# EAGLE schematic ZEROSTICK (EAGLE 9.6.2)

## Sheet 1 of 2
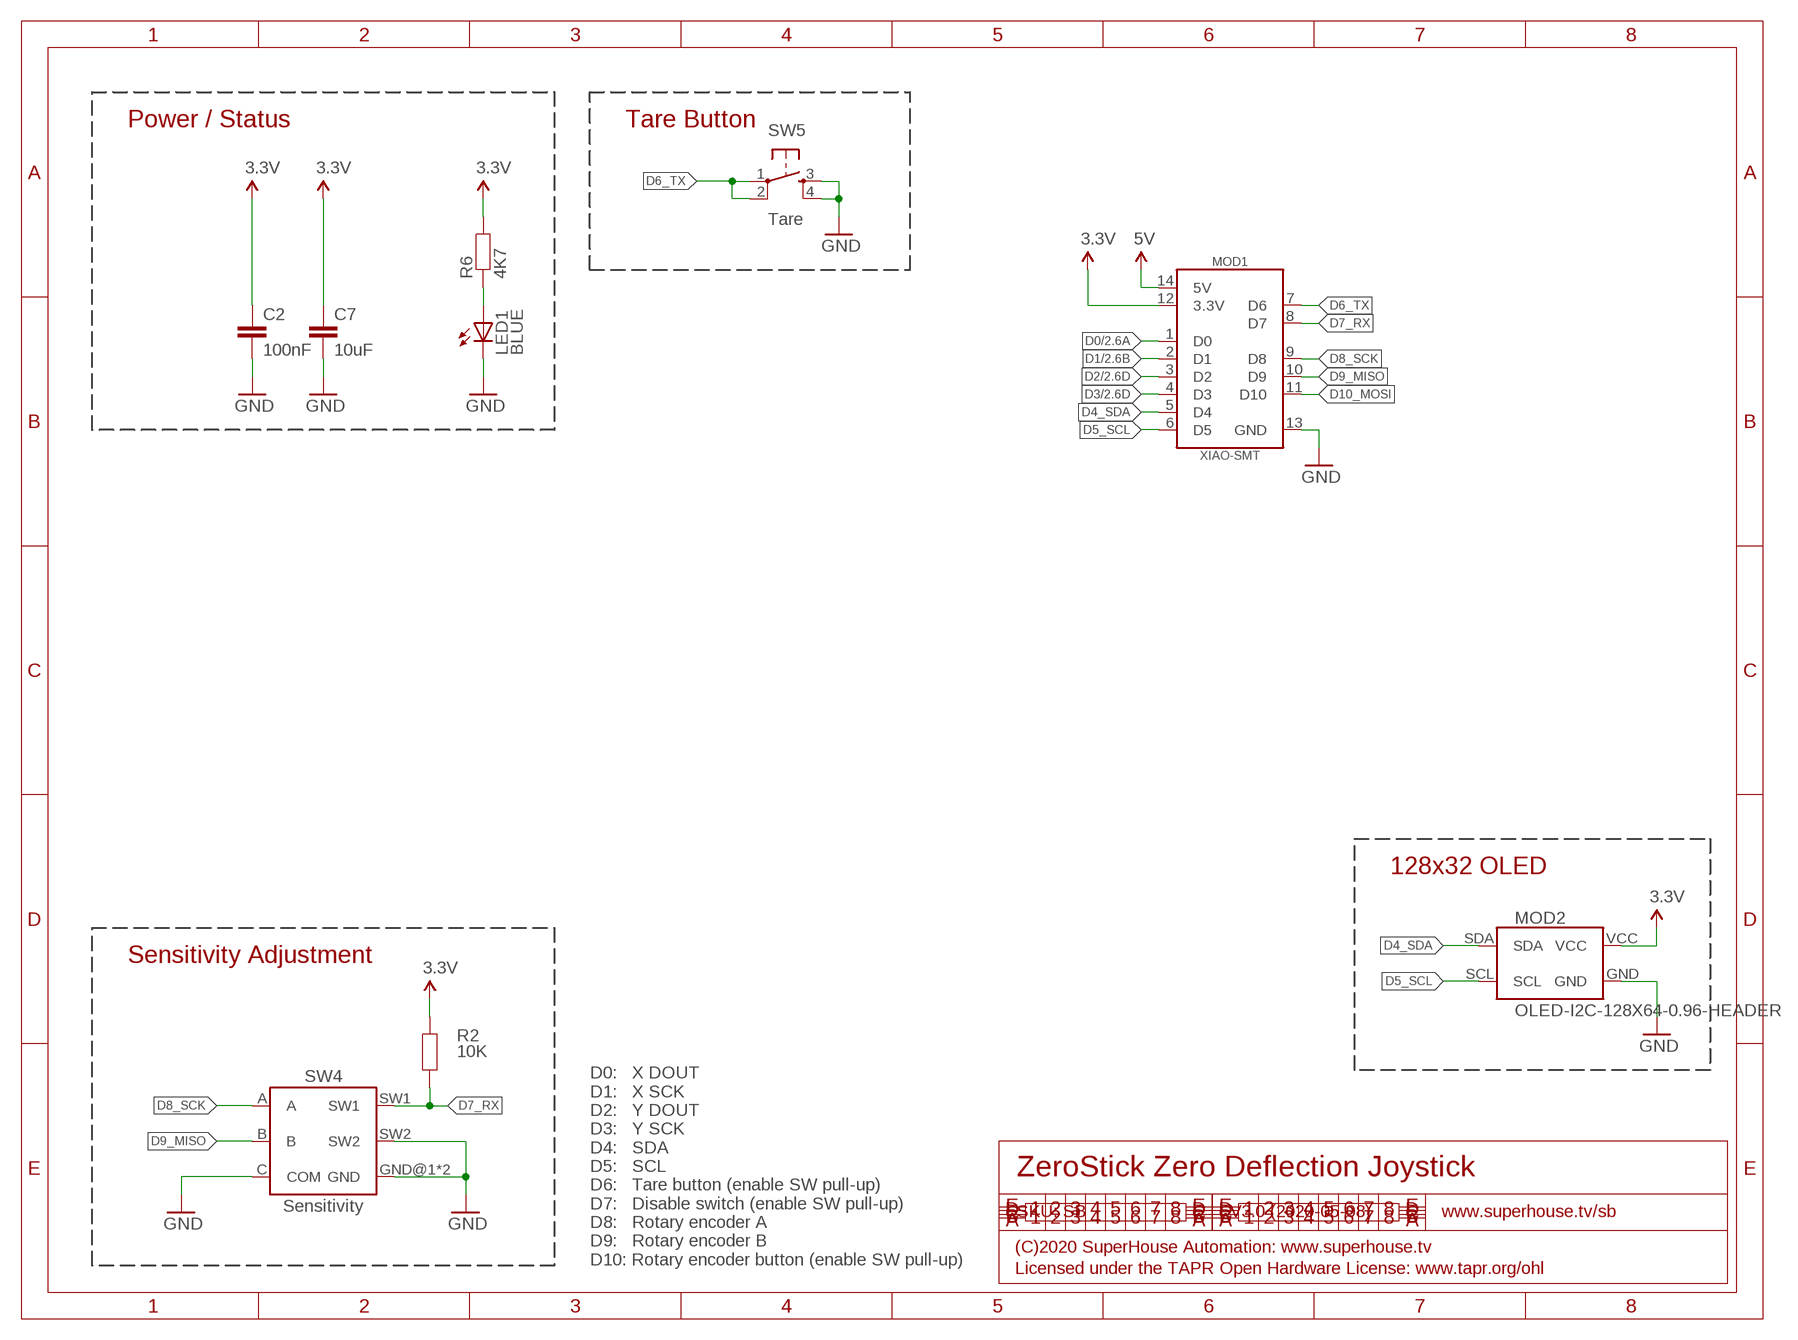
[diagram p0: schematic, sheet 1]

### Parts
C2  100nF  CAP0603  [C0603]
C7  10uF  CAP0805  [C0805]
LED1  BLUE  LED0603  [LED-0603]
MOD1  XIAO-SMT  [XIAO-SMT]
MOD2  OLED-I2C-128X64-0.96-HEADER  [OLED-128X64-0.96-HEADER]
R2  10K  RESISTOR0603  [R0603]
R6  4K7  RESISTOR0603  [R0603]
SW4  Sensitivity  ENCODER  [PEC12R]
SW5  Tare  TAC_SWITCH-PTH-4.5  [TACTILE-PTH-4.5MM]

### Nets
3.3V: C2.1 C7.1 MOD1.12(3.3V) MOD2.VCC R2.2 R6.2 ; also sheet 2
5V: MOD1.14(5V)
D0: MOD1.1(D0) ; also sheet 2
D1: MOD1.2(D1) ; also sheet 2
D2: MOD1.3(D2) ; also sheet 2
D3: MOD1.4(D3) ; also sheet 2
D4_SDA: MOD1.5(D4) MOD2.SDA
D5_SCL: MOD1.6(D5) MOD2.SCL
D6_TX: MOD1.7(D6) SW5.1 SW5.2
D7_RX: MOD1.8(D7) R2.1 SW4.SW1
D8_SCK: MOD1.9(D8) SW4.A
D9_MISO: MOD1.10(D9) SW4.B
D10_MOSI: MOD1.11(D10)
GND: C2.2 C7.2 LED1.C MOD1.13(GND) MOD2.GND SW4.C(COM) SW4.GND@1(GND) SW4.GND@2(GND) SW4.SW2 SW5.3 SW5.4 ; also sheet 2
N$5: LED1.A R6.1

### Notes on the sheet
- Power / Status | Tare Button
- 128x32 OLED
- Sensitivity Adjustment
- ZeroStick Zero Deflection Joystick
- SKU: SB | V3.0 (2020-05-08) | www.superhouse.tv/sb
- (C)2020 SuperHouse Automation: www.superhouse.tv
- D0:   X DOUT
  D1:   X SCK
  D2:   Y DOUT
  D3:   Y SCK
  D4:   SDA
  D5:   SCL
  D6:   Tare button (enable SW pull-up)
  D7:   Disable switch (enable SW pull-up)
  D8:   Rotary encoder A
  D9:   Rotary encoder B
  D10: Rotary encoder button (enable SW pull-up)
- Licensed under the TAPR Open Hardware License: www.tapr.org/ohl

## Sheet 2 of 2
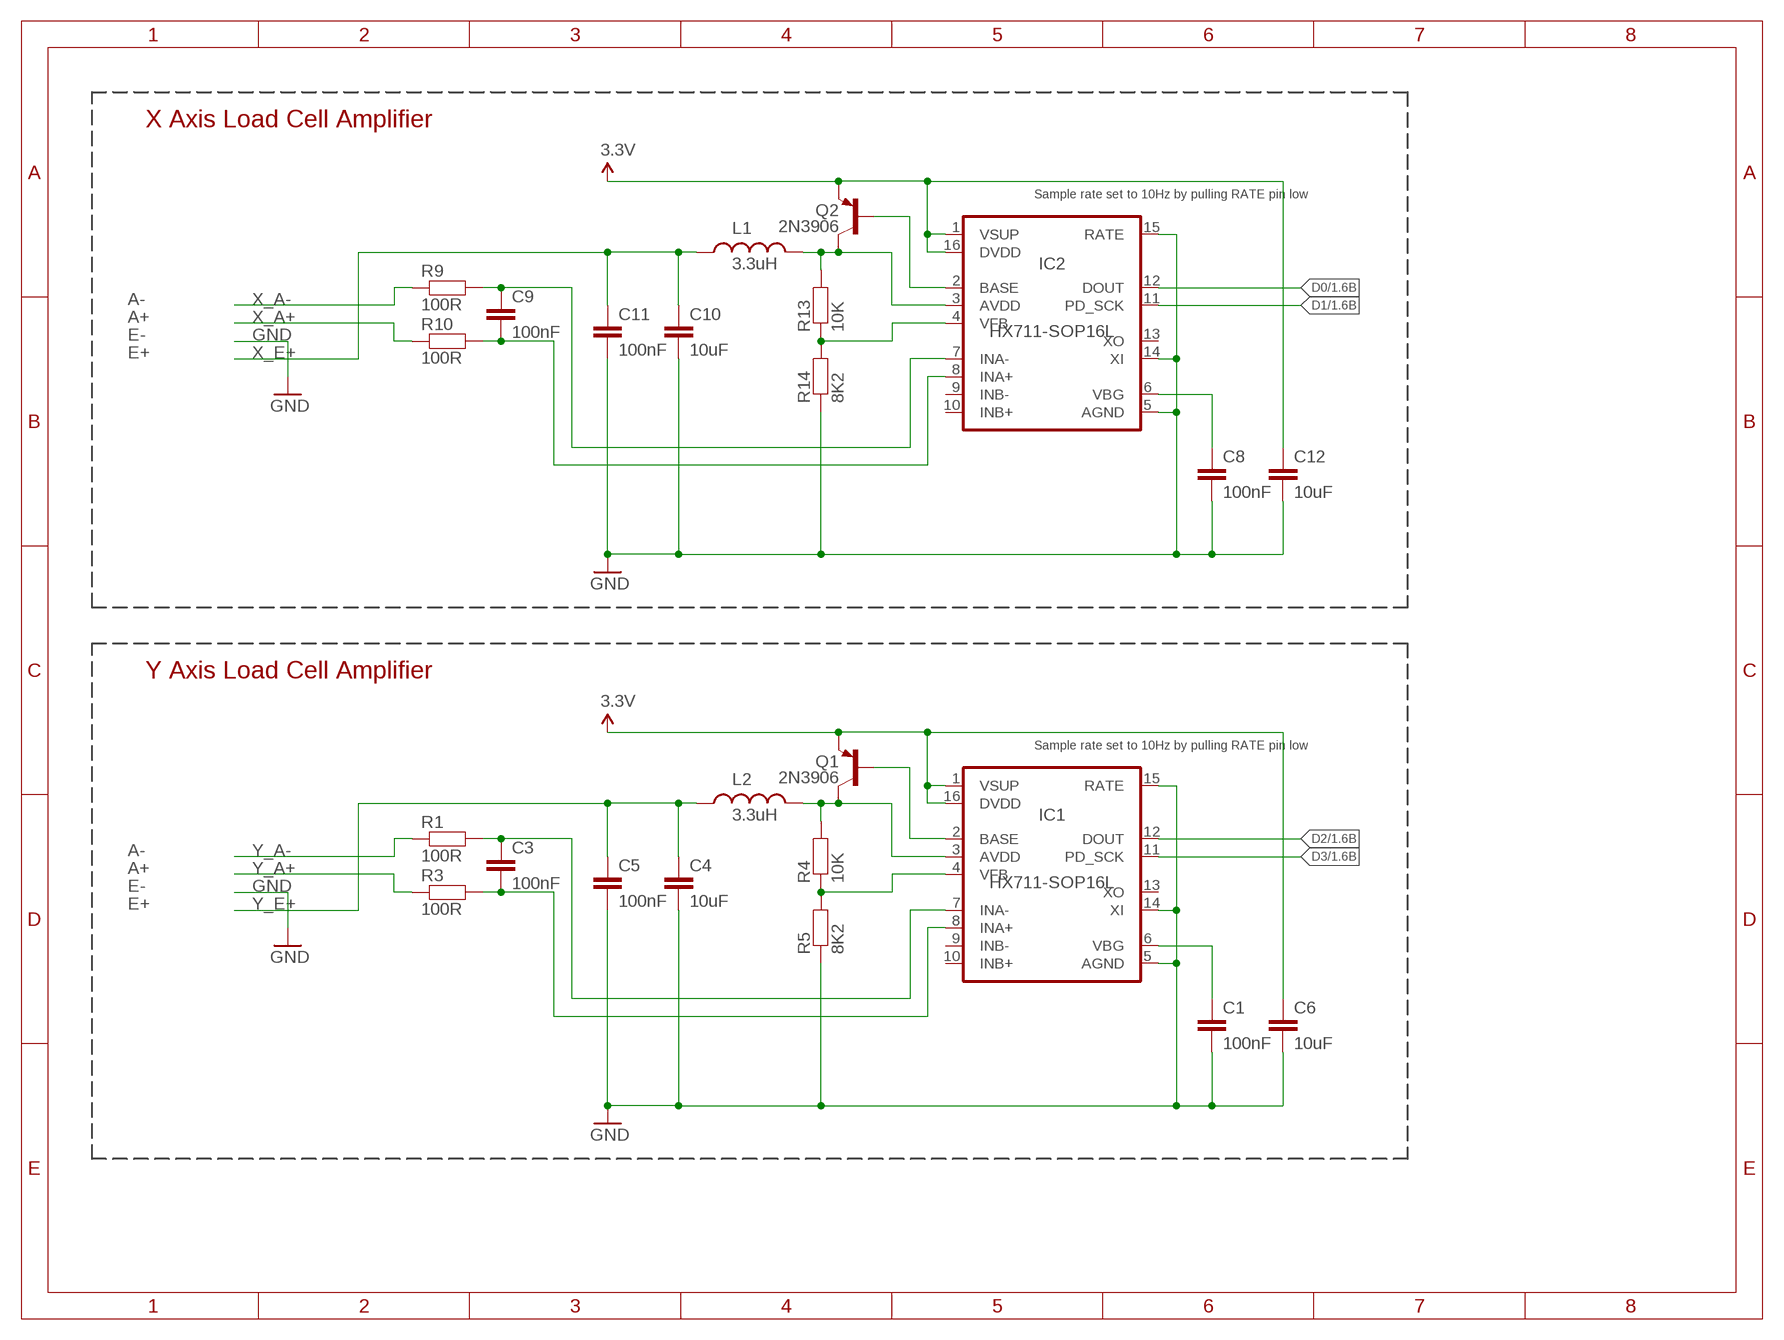
[diagram p1: schematic, sheet 2]

### Parts
C1  100nF  CAP0603  [C0603]
C3  100nF  CAP0603  [C0603]
C4  10uF  CAP0805  [C0805]
C5  100nF  CAP0603  [C0603]
C6  10uF  CAP0805  [C0805]
C8  100nF  CAP0603  [C0603]
C9  100nF  CAP0603  [C0603]
C10  10uF  CAP0805  [C0805]
C11  100nF  CAP0603  [C0603]
C12  10uF  CAP0805  [C0805]
IC1  HX711-SOP16L  [SOP16-L]
IC2  HX711-SOP16L  [SOP16-L]
L1  3.3uH  INDUCTOR0603  [L0603]
L2  3.3uH  INDUCTOR0603  [L0603]
Q1  2N3906  TRANS_PNPMMBT3906LT1SOT23-BEC  [SOT23-BEC]
Q2  2N3906  TRANS_PNPMMBT3906LT1SOT23-BEC  [SOT23-BEC]
R1  100R  RESISTOR0603  [R0603]
R3  100R  RESISTOR0603  [R0603]
R4  10K  RESISTOR0603  [R0603]
R5  8K2  RESISTOR0603  [R0603]
R9  100R  RESISTOR0603  [R0603]
R10  100R  RESISTOR0603  [R0603]
R13  10K  RESISTOR0603  [R0603]
R14  8K2  RESISTOR0603  [R0603]

### Nets
3.3V: C6.1 C12.1 IC1.1(VSUP) IC1.16(DVDD) IC2.1(VSUP) IC2.16(DVDD) Q1.E Q2.E ; also sheet 1
D0: IC2.12(DOUT) ; also sheet 1
D1: IC2.11(PD_SCK) ; also sheet 1
D2: IC1.12(DOUT) ; also sheet 1
D3: IC1.11(PD_SCK) ; also sheet 1
GND: C1.2 C4.2 C5.2 C6.2 C8.2 C10.2 C11.2 C12.2 IC1.5(AGND) IC1.14(XI) IC1.15(RATE) IC2.5(AGND) IC2.14(XI) IC2.15(RATE) R5.1 R14.1 ; also sheet 1
N$1: C3.1 IC1.7(INA-) R1.2
N$2: C3.2 IC1.8(INA+) R3.2
N$3: C1.1 IC1.6(VBG)
N$4: IC1.2(BASE) Q1.B
N$6: IC1.4(VFB) R4.1 R5.2
N$7: IC1.3(AVDD) L2.2 Q1.C R4.2
N$14: C9.1 IC2.7(INA-) R9.2
N$15: C9.2 IC2.8(INA+) R10.2
N$16: IC2.3(AVDD) L1.2 Q2.C R13.2
N$17: C8.1 IC2.6(VBG)
N$20: IC2.2(BASE) Q2.B
N$21: IC2.4(VFB) R13.1 R14.2
X_A+: R10.1
X_A-: R9.1
X_E+: C10.1 C11.1 L1.1
Y_A+: R3.1
Y_A-: R1.1
Y_E+: C4.1 C5.1 L2.1
Unconnected: IC1.9(INB-) IC1.10(INB+) IC2.9(INB-) IC2.10(INB+)

### Notes on the sheet
- X Axis Load Cell Amplifier
- Sample rate set to 10Hz by pulling RATE pin low
- A-
- A+
- E-
- E+
- Y Axis Load Cell Amplifier
- Sample rate set to 10Hz by pulling RATE pin low
- A-
- A+
- E-
- E+

## Power pins joined to a net without a drawn wire
XO: IC1.13(XO) IC2.13(XO)

## Library data of the parts
C1-C12 = SuperHouse-DiscreteSemi:CAP: Capacitor Standard ceramic capacitor
IC1 IC2 = SuperHouse-ICs:HX711: HX711 strain gauge amplifier
L1 L2 = SuperHouse-DiscreteSemi:INDUCTOR: Inductors Basic Inductor/Choke - 0603 and 1206. Footprints are not proven and vary greatly between part numbers.
LED1 = SuperHouse-LEDs:LED: LEDs Standard schematic elements and footprints for 5mm, 3mm, 1206, and 0603 sized LEDs. 5mm - Spark Fun Electronics SKU : COM-00529 (and others)
MOD1 = SuperHouse-Modules:XIAO: Seeeduino XIAO
MOD2 = SuperHouse-Displays:OLED-I2C: OLED module with SSD1306 I2C driver
Q1 Q2 = SuperHouse-DiscreteSemi:TRANS_PNP: PNP Transistror
R1-R6 R9 R10 R13 R14 = SuperHouse-DiscreteSemi:RESISTOR: Resistor Standard resistors.
SW4 = SuperHouse-Switches:ENCODER: Rotary encoder with switch
SW5 = SuperHouse-Switches:TAC_SWITCH: Momentary Switch Tactile switch, normally-open.